# Altium schematic sheet potenciometros.SchDoc
size A4
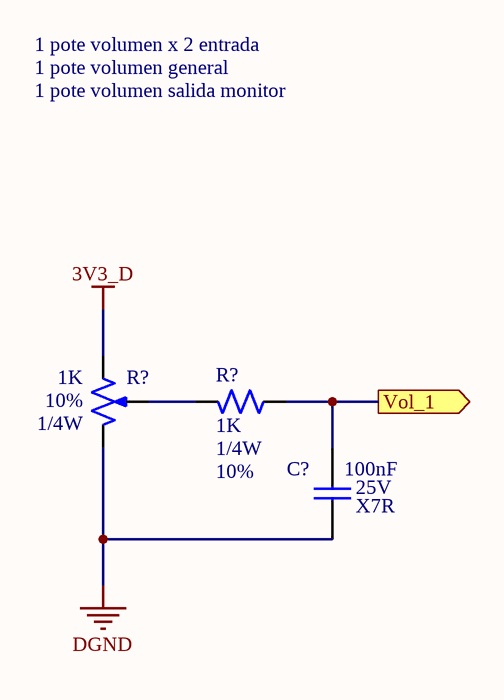
[diagram p0: potenciometros.SchDoc]

## Parts
(Parts that share a designator on the sheet are numbered #1, #2 ... from top to bottom, then left to right.)
C?  valor: 100nF  tension: 25V  tolerancia: X7R  [C0805]  (hidden comment: Capacitor)
R?#1  valor: 1K  Tolerancia: 10%  Potencia: 1/4W  [POTE]  (hidden comment: Potenciometro)
R?#2  Valor: 1K  Potencia: 1/4W  Tolerancia: 10%  [R0603]  (hidden comment: Resistor)

## Ports
Vol_1 (out)

## Nets
3V3_D: R?#1.2
DGND: C?.2 R?#1.1
Vol_1: C?.1 R?#2.1 ; port Vol_1
NetR?#1_1: R?#1.1 R?#2.2

## Notes on the sheet
- 1 pote volumen x 2 entrada
- 1 pote volumen general
- 1 pote volumen salida monitor

## Library data of the parts
C? = Capacitor: Capacitor de placas paralelas; Encapsulado: 0805
R?#1 = Potenciometer
R?#2 = Resistor: Resistencia